# Altium schematic sheet Main.SchDoc
size A3; PageSetup: Record=PageOptions|CenterHorizontal=True|CenterVertical=True|PrintScale=1.47|XCorrection=1.00|YCorrection=1.00|PrintKind=1|BorderSize=5000000|LeftOffset=0|BottomOffset=0|Orientation=2|PaperLength=1000|PaperWidth=1000|Scale=100|PaperSource=7|PrintQuality=-4|MediaType=1|DitherType=10|PrintScaleMode=1|PaperKind=A2 420 x 594 мм
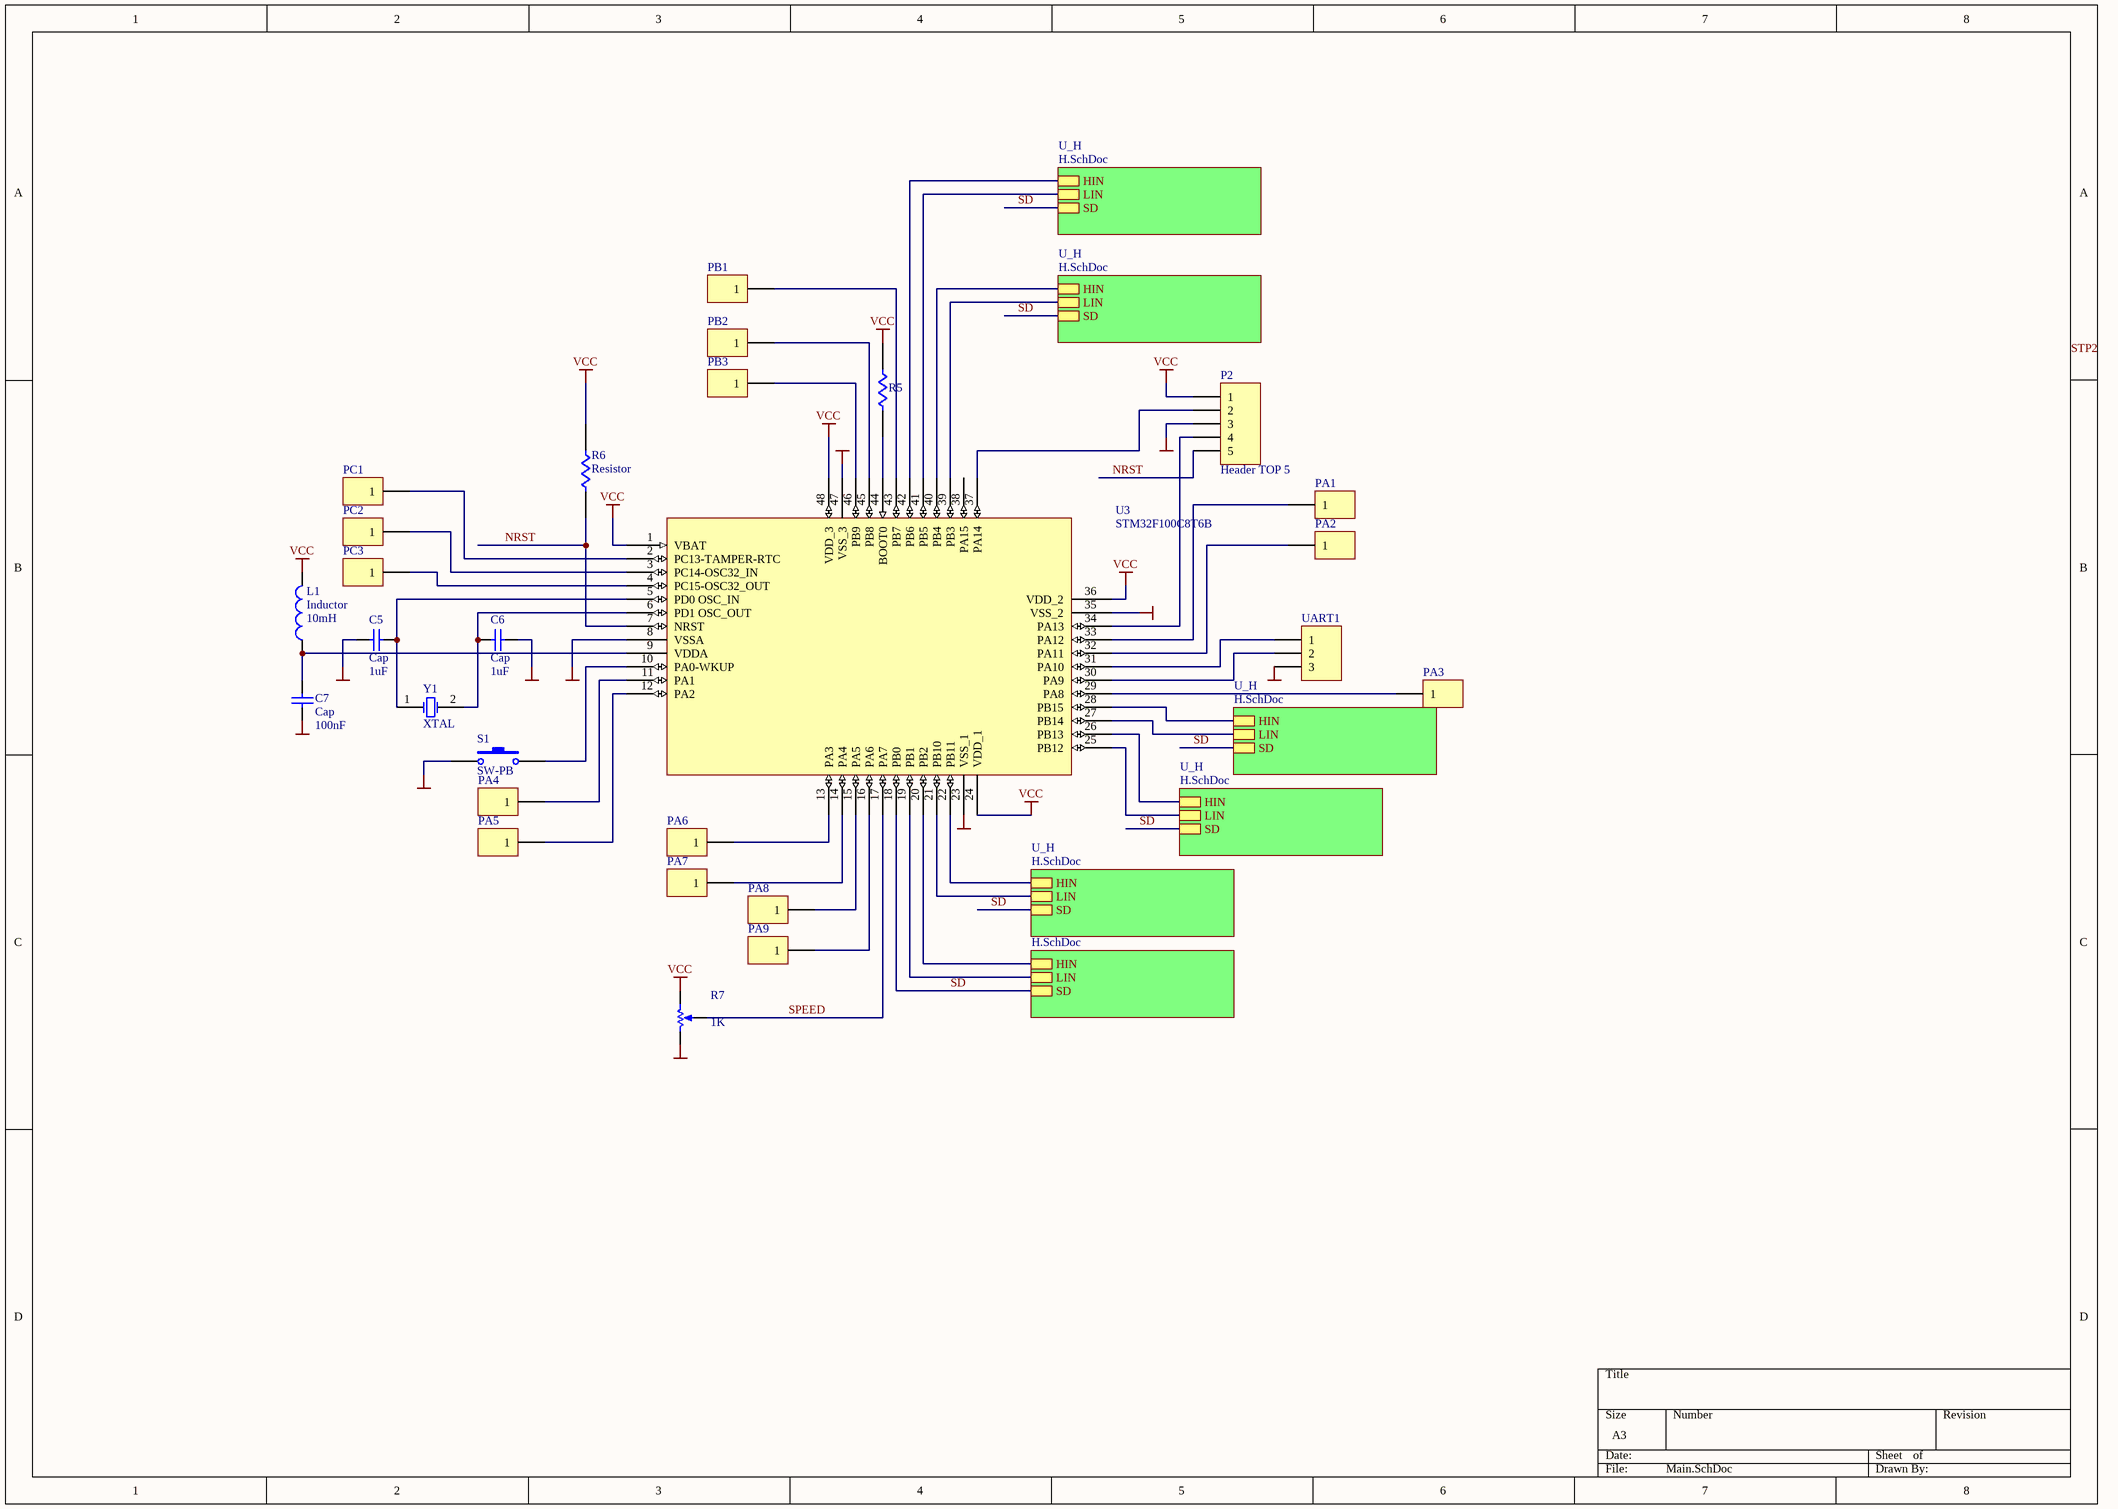
[diagram p0: Main.SchDoc]

## Parts
C5  Cap  value 1uF  [6-0805_M]
C6  Cap  value 1uF  [6-0805_M]
C7  Cap  value 100nF  [6-0805_M]
L1  Inductor  value 10mH  [INDC4532]
P2  Header TOP 5  [PIN_TOP_SMALL_5]
PA1  Header TOP 1  [PIN1]  (value not drawn)
PA2  Header TOP 1  [PIN1]  (value not drawn)
PA3  Header TOP 1  [PIN1]  (value not drawn)
PA4  Header TOP 1  [PIN1]  (value not drawn)
PA5  Header TOP 1  [PIN1]  (value not drawn)
PA6  Header TOP 1  [PIN1]  (value not drawn)
PA7  Header TOP 1  [PIN1]  (value not drawn)
PA8  Header TOP 1  [PIN1]  (value not drawn)
PA9  Header TOP 1  [PIN1]  (value not drawn)
PB1  Header TOP 1  [PIN1]  (value not drawn)
PB2  Header TOP 1  [PIN1]  (value not drawn)
PB3  Header TOP 1  [PIN1]  (value not drawn)
PC1  Header TOP 1  [PIN1]  (value not drawn)
PC2  Header TOP 1  [PIN1]  (value not drawn)
PC3  Header TOP 1  [PIN1]  (value not drawn)
R5  Resistor  [6-0805_M]  (value not drawn)
R6  Resistor  [6-0805_M]
R7  value 1K  [VR5]  (hidden comment: RPot)
S1  SW-PB  [SPST-2]
U3  STM32F100C8T6B  [TQFP48_L]
UART1  Header TOP 3  [PIN_TOP_SMALL_3]  (value not drawn)
Y1  XTAL  [RAD-0.3]

## Sub-sheets
U_H = H.SchDoc: HIN, LIN, SD
U_H = H.SchDoc: HIN, LIN, SD
U_H = H.SchDoc: HIN, LIN, SD
U_H = H.SchDoc: HIN, LIN, SD
U_H = H.SchDoc: HIN, LIN, SD
U_H = H.SchDoc: HIN, LIN, SD

## Nets
GND: C5.2 C6.1 C7.1 P2.3 R7.2(BOT) S1.1 U3.8(VSSA) U3.23(VSS_1) U3.35(VSS_2) U3.47(VSS_3) UART1.3
VCC: L1.2 P2.1 R5.2 R6.1 R7.1(TOP) U3.1(VBAT) U3.24(VDD_1) U3.36(VDD_2) U3.48(VDD_3)
NRST: P2.5 R6.2 U3.7(NRST)
SD: U3.18(PB0) ; sheet U_H/SD, sheet U_H/SD, sheet U_H/SD, sheet U_H/SD, sheet U_H/SD, sheet U_H/SD
SPEED: R7.3(TAP) U3.17(PA7)
NetC5_1: C5.1 U3.5(PD0_OSC_IN) Y1.1(OSC1)
NetC6_2: C6.2 U3.6(PD1_OSC_OUT) Y1.2(OSC2)
NetC7_2: C7.2 L1.1 U3.9(VDDA)
NetP2_2: P2.2 U3.37(PA14)
NetP2_4: P2.4 U3.34(PA13)
NetPA1_1: PA1.1 U3.33(PA12)
NetPA2_1: PA2.1 U3.32(PA11)
NetPA3_1: PA3.1 U3.29(PA8)
NetPA4_1: PA4.1 U3.11(PA1)
NetPA5_1: PA5.1 U3.12(PA2)
NetPA6_1: PA6.1 U3.13(PA3)
NetPA7_1: PA7.1 U3.14(PA4)
NetPA8_1: PA8.1 U3.15(PA5)
NetPA9_1: PA9.1 U3.16(PA6)
NetPB1_1: PB1.1 U3.43(PB7)
NetPB2_1: PB2.1 U3.45(PB8)
NetPB3_1: PB3.1 U3.46(PB9)
NetPC1_1: PC1.1 U3.2(PC13-TAMPER-RTC)
NetPC2_1: PC2.1 U3.3(PC14-OSC32_IN)
NetPC3_1: PC3.1 U3.4(PC15-OSC32_OUT)
NetR5_1: R5.1 U3.44(BOOT0)
NetS1_2: S1.2 U3.10(PA0-WKUP)
NetU3_19: U3.19(PB1) ; sheet U_H/LIN
NetU3_20: U3.20(PB2) ; sheet U_H/HIN
NetU3_21: U3.21(PB10) ; sheet U_H/LIN
NetU3_22: U3.22(PB11) ; sheet U_H/HIN
NetU3_25: U3.25(PB12) ; sheet U_H/LIN
NetU3_26: U3.26(PB13) ; sheet U_H/HIN
NetU3_27: U3.27(PB14) ; sheet U_H/LIN
NetU3_28: U3.28(PB15) ; sheet U_H/HIN
NetU3_30: U3.30(PA9) UART1.2
NetU3_31: U3.31(PA10) UART1.1
NetU3_39: U3.39(PB3) ; sheet U_H/LIN
NetU3_40: U3.40(PB4) ; sheet U_H/HIN
NetU3_41: U3.41(PB5) ; sheet U_H/LIN
NetU3_42: U3.42(PB6) ; sheet U_H/HIN

Not connected (* = marked no-connect by the designer): U3 38(PA15)

## Notes on the sheet
- Labels drawn without touching a wire or pin: STP2

## Library data of the parts
C5-C7 = Cap: Capacitor; Published: 8-Jun-2000; LatestRevisionDate: 17-Jul-2002; LatestRevisionNote: Re-released for DXP Platform.; PackageReference: RAD-0.3; Publisher: Altium Limited; PackageDescription: Radial Cap, Thru-Hole; 2 Leads; 0.3 in Pin Spacing
L1 = Inductor: Code_IEC: 1005; Published: 8-Jun-2000; LatestRevisionDate: 29-May-2009; LatestRevisionNote: IPC-7351 Footprint Added.; PackageReference: 0402-A; Publisher: Altium Limited; PackageDescription: Chip Inductor; Code_JEITA: 0402
P2 = Header TOP 5: Header, 1Pin; LatestRevisionDate: 17-Jul-2002; LatestRevisionNote: Re-released for DXP Platform.; Publisher: Altium Limited
PA1-PA9 PB1-PB3 PC1-PC3 = Header TOP 1: Header, 1Pin; LatestRevisionDate: 17-Jul-2002; LatestRevisionNote: Re-released for DXP Platform.; Publisher: Altium Limited
R7 = RPot: Potentiometer; Sim Note: Enter the Resistance value and the set point into parameter fields.; Set Position: 0.5; Published: 8-Jun-2000; LatestRevisionDate: 17-Jul-2002; LatestRevisionNote: Re-released for DXP Platform.; PackageReference: VR5; Publisher: Altium Limited; PackageDescription: Variable Resistor, Thru-Hole; 3 Leads
S1 = SW-PB: Switch; Published: 24-Mar-1999; LatestRevisionDate: 17-Jul-2002; LatestRevisionNote: Re-released for DXP Platform.; PackageReference: SPST-2; Publisher: Altium Limited; PackageDescription: Switch; 2 Leads
U3 = STM32F100C8T6B: STM32 ARM-based 32-bit MCU with 32 Kbytes Flash, 48-pin LQFP, Industrial Temperature; Published: 30-May-2008; DatasheetVersion: rev6, Mar-2008; PackageVersion: Mar-2008; PackageReference: LQFP48; Publisher: Altium Limited; PackageDescription: 48-Pin Low-Profile Quad Flat Pack, 7 x 7 mm Body, 0.5 mm Pitch (LQFP48); ComponentLink1Description: Manufacturer Link; ComponentLink1URL: www.st.com/stm32; ComponentLink2Description: Datasheet; ComponentLink2URL: http://www.st.com/stonline/products/literature/ds/13586.pdf
UART1 = Header TOP 3: Header, 1Pin; LatestRevisionDate: 17-Jul-2002; LatestRevisionNote: Re-released for DXP Platform.; Publisher: Altium Limited
Y1 = XTAL: Crystal Oscillator; Published: 8-Jun-2000; LatestRevisionDate: 17-Jul-2002; LatestRevisionNote: Re-released for DXP Platform.; PackageReference: R38; Publisher: Altium Limited; PackageDescription: Crystal, Thru-Hole; 2 Leads; Body 3.1 x 8.2 mm (Dia.xH)
R5 R6 = Resistor: Published: 24-Mar-1999; LatestRevisionDate: 29-May-2009; LatestRevisionNote: IPC-7351 Footprint Added.; PackageVersion: Mar-2003; PackageReference: 6-0805; Publisher: Altium Limited; PackageDescription: Chip Resistor 0805 Case Size; Code_IPC: RESC2012